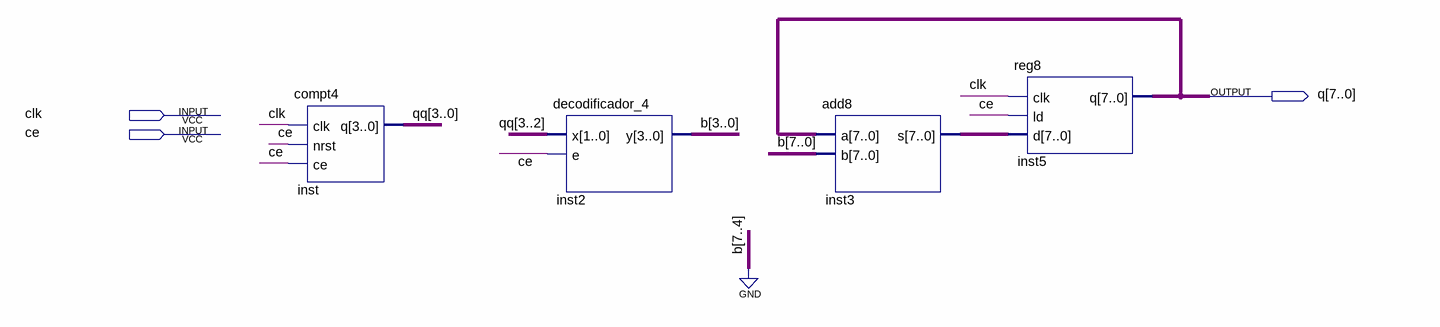
[diagram p0: schematic sheet]
// Quartus schematic 2017TG33.bdf as structural Verilog: 4 symbols, 3 pins
module \2017TG33  (
  input  clk,
  input  ce,
  output [7:0] q
);

  wire [3:0] b, qq;
  wire [7:0] inst3_s;

  compt4 inst (.clk(clk), .nrst(ce), .ce(ce), .q(qq));
  decodificador_4 inst2 (.x(qq[3:2]), .e(ce), .y(b));
  add8 inst3 (.a(q), .b({4'b0000, b}), .s(inst3_s));
  reg8 inst5 (.clk(clk), .ld(ce), .d(inst3_s), .q(q));
endmodule
